# EasyEDA Pro project 蠕动泵.eprj

# Schematic Schematic1
Board Name: Board1; Create Date: 2025-11-30; Page Name: 控制; Project Name: 蠕动泵; Schematic Name: Schematic1; Update Date: 2025-12-03; Company: 嘉立创EDA; Page Size: A4; Version: V1.0
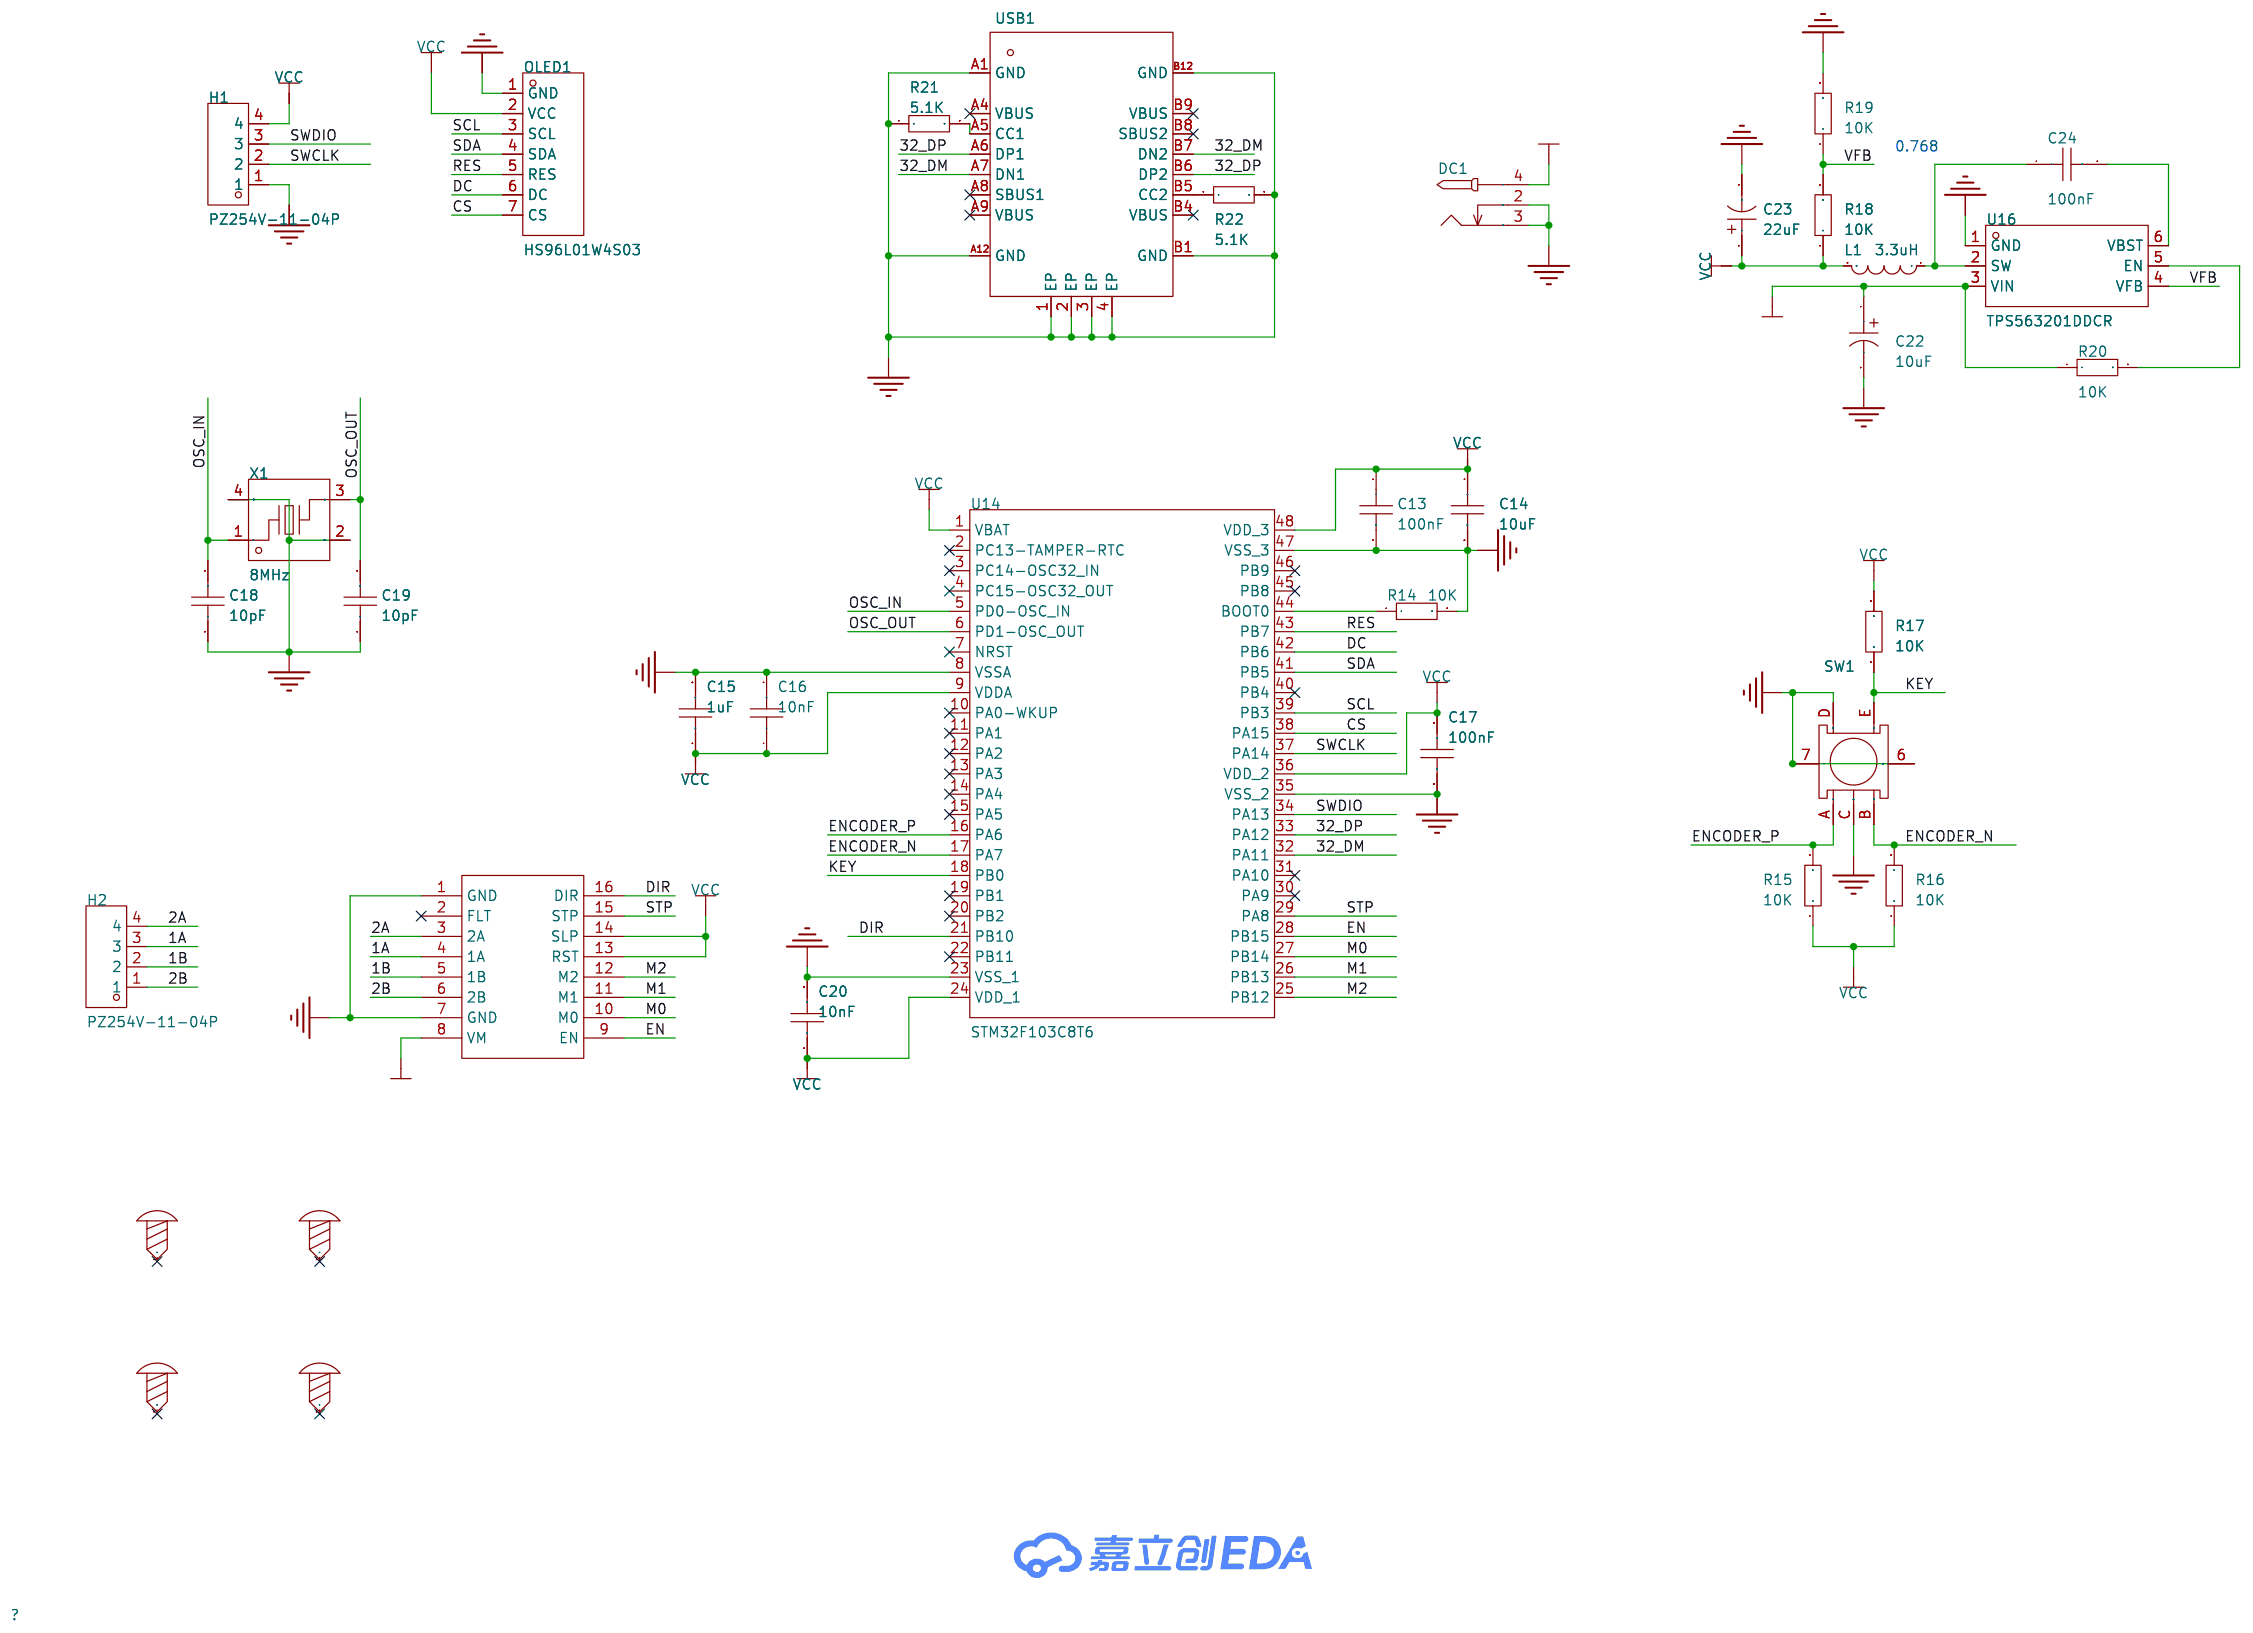
[diagram p0: schematic sheet]

## Parts
C13  100nF  [C0603]
C14  10uF  [C0603]
C15  1uF  [C0603]
C16  10nF  [C0603]
C17  100nF  [C0603]
C18  10pF  [C0603]
C19  10pF  [C0603]
C20  10nF  [C0603]
C22  10uF  [CAP-TH_BD4.0-P1.50-D0.5-FD]
C23  22uF  [CAP-TH_BD5.0-P2.00-D0.5-FD-1]
C24  100nF  [C0603]
DC1  -  [DC-2.0]
H1  PZ254V-11-04P  [HDR-TH_4P-P2.54-V-M]
H2  PZ254V-11-04P  [HDR-TH_4P-P2.54-V-M]
L1  3.3uH  [IND-SMD_L2.5-W2.0_AHP252010X]
OLED1  HS96L01W4S03  [OLED-TH_HS96L01W4S03]
R14  10K  [R0603]
R15  10K  [R0603]
R16  10K  [R0603]
R17  10K  [R0603]
R18  10K  [R0603]
R19  10K  [R0603]
R20  10K  [R0603]
R21  5.1K  [R0603]
R22  5.1K  [R0603]
SCREW1  -  [M3螺丝]
SCREW2  -  [M3螺丝]
SCREW3  -  [M3螺丝]
SCREW4  -  [M3螺丝]
SW1  -  [旋转编码器]
U1  -  [DRV8825模块]
U14  STM32F103C8T6  [LQFP-48_L7.0-W7.0-P0.50-LS9.0-BL]
U16  TPS563201DDCR  [SOT-23-6_L2.9-W1.6-P0.95-LS2.8-BR]
USB1  -  [USB_TYPE-C-16P]
X1  8MHz  [CRYSTAL-SMD_4P-L3.2-W2.5-BL]

## Library data of the parts
C13-C20 C24 = CAP_0603: Supplier Footprint: 0603
C22 = ECE-A1CKS100I: LCSC Part Name: 10uF ±20% 16V; Supplier Part: C1579406; Manufacturer: PANASONIC(松下); Supplier Footprint: 插件,D4xL5mm; JLCPCB Part Class: 扩展库; Datasheet: https://item.szlcsc.com/datasheet/ECE-A1CKS100I/1670221.html; Supplier: LCSC; Tolerance: ±20%; Voltage Rating: 16V; Ripple Current: 28mA@120Hz; Pin Spacing: 2.5mm; Diameter: 4mm; Height - Seated (Max): 5mm; Lifetime: 1000hrs@85℃; Operating Temperature: -40℃~+85℃
C23 = RGA220M1HBK-0511: LCSC Part Name: 22uF ±20% 50V; Supplier Part: C2920651; Manufacturer: Lelon(立隆); Supplier Footprint: 插件,D5xL11mm; JLCPCB Part Class: 扩展库; Datasheet: https://item.szlcsc.com/datasheet/RGA220M1HBK-0511/3224960.html; Supplier: LCSC; Tolerance: ±20%; Voltage Rating: 50V; Diameter: 5mm; Height - Seated (Max): 11mm; Operating Temperature: -40℃~+105℃
DC1 = DC-005_2.0: Supplier Footprint: 插件
H1 H2 = PZ254V-11-04P: LCSC Part Name: 1x4P 间距:2.54mm 方针 直插; Supplier Part: C2691448; Manufacturer: XFCN(兴飞); Supplier Footprint: 插件,P=2.54mm; JLCPCB Part Class: Extended Part; Datasheet: https://item.szlcsc.com/datasheet/PZ254V-11-04P/2801085.html; Supplier: LCSC; Pin Structure: 1x4P; Pitch: 2.54mm; Circluar Pins/Square Pins: 方针; Mounting Type: 直插; Number of Rows: 单排; Number of Pins: 4P; Current Rating: 3A; Voltage Rating (Max): 250V; Length of Mating Pin: 6mm; Insulation Height: 2.5mm; Length of End Connection Pin: 3mm; Operating Temperature: -40℃~+105℃; Color: 黑色
L1 = 74404024033: LCSC Part Name: 3.3uH ±20% 1.25A; Supplier Part: C2047400; Manufacturer: Wurth(伍尔特); Supplier Footprint: 2520; JLCPCB Part Class: 扩展库; Datasheet: https://www.we-online.com/components/products/datasheet/74404024033.pdf; Supplier: LCSC; Tolerance: ±20%; Current - Saturation(Isat): 1.25A; DC Resistance(DCR): 120mΩ; Ratings: AEC-Q200
OLED1 = HS96L01W4S03: LCSC Part Name: 0.96寸 白光 128x64像素分辨率; Supplier Part: C5139758; Manufacturer: HS(汉昇); JLCPCB Part Class: 扩展库; Datasheet: https://atta.szlcsc.com/upload/public/pdf/source/20231102/B1697FD352320B8236C71C910449C6BA.pdf; Supplier: LCSC
R14-R22 = Res_0603: Supplier Footprint: 0603
SCREW1-SCREW4 = M3螺丝: Supplier Footprint: 插件
SW1 = EC11E15244B2: Supplier Footprint: 插件
U1 = DRV8825模块
U14 = STM32F103C8T6: CPU内核:ARM Cortex-M3;CPU最大主频:72MHz;工作电压范围:2V~3.6V;内部振荡器:有;程序 FLASH容量:64K@x8bit;RAM总容量:20KB;EEPROM/数据 FLASH容量:-;GPIO端口数量:37;ADC(单元数/通道数/位数):1@x10ch/12bit;外设/功能/协议栈:温度传感器；DMA；看门狗；POR；PWM;工作温度范围:-40℃~+85℃;; LCSC Part Name: ARM Cortex-M3 72MHz 64K@x8bit 20KB MSL=3; Supplier Part: C8734; Manufacturer: ST(意法半导体); Supplier Footprint: LQFP-48_7x7x05P; JLCPCB Part Class: Basic Part; Datasheet: https://atta.szlcsc.com/upload/public/pdf/source/20140724/1457707174202.pdf; Supplier: LCSC; CPU Core: ARM Cortex-M3; Maximum Frequency: 72MHz; Supply Voltage Range: 2V~3.6V; Internal Oscillator: 有; Program FLASH Size: 64K@x8bit; RAM Size: 20KB; GPIO Ports Number: 37; ADC (Units/Channels/bits): 1@x10ch/12bit; Peripherals / Functions / Protocol Stacks: 温度传感器；DMA；看门狗；POR；PWM; Operating Temperature Range: -40℃~+85℃
U16 = TPS563201DDCR: LCSC Part Name: 4.5V至17V输入，3A同步降压电压调节器; Supplier Part: C116592; Manufacturer: TI(德州仪器); Supplier Footprint: SOT-23-THIN-6; JLCPCB Part Class: 扩展库; Datasheet: https://item.szlcsc.com/datasheet/TPS563201DDCR/117846.html; Supplier: LCSC; Function: 降压型; Output Type: 可调; Voltage - Supply: 4.5V~17V; Output Voltage: 768mV~7V; Output Current: 3A; Frequency - Switching: 580kHz; Operating Temperature: -40℃~+125℃@(TJ); Synchronous Rectifier: 是; Number of Outputs: 1; Topology: 降压式; Switch tube (built-in/external): 内置
USB1 = USB_TYPE-C-16P: Supplier Footprint: SMD
X1 = X32258MSB4SI: 晶振类型:贴片晶振;频率:8MHz;常温频差:±10ppm;负载电容:20pF;频率稳定度:±20ppm;; LCSC Part Name: YSX321SL 8MHZ 4P 3225 20PF ±10PPM -40~85℃ (±20PPM); Supplier Part: C2682774; Manufacturer: YXC(扬兴晶振); Supplier Footprint: SMD3225-4P; JLCPCB Part Class: 扩展库; Datasheet: https://item.szlcsc.com/datasheet/X32258MSB4SI/2777871.html; Supplier: LCSC; Type: 贴片晶振; Normal temperature Frequency Tolerance: ±10ppm; Load Capacitance: 20pF; Frequency Stability: ±20ppm; Equivalent Series Resistance(ESR): 120Ω; Operating Temperature: -40℃~+85℃

## Nets
12V: C22.1 DC1.4 R20.1 U1.8(VM) U16.3(VIN)
GND: C13.2 C14.2 C15.2 C16.2 C17.2 C18.1 C19.1 C20.2 C22.2 C23.2 DC1.2 DC1.3 H1.1 OLED1.1(GND) R14.2 R19.2 R21.1 R22.2 SW1.6 SW1.7 SW1.C SW1.D U1.1(GND) U1.7(GND) U14.8(VSSA) U14.23(VSS_1) U14.35(VSS_2) U14.47(VSS_3) U16.1(GND) USB1.1(EP) USB1.2(EP) USB1.3(EP) USB1.4(EP) USB1.A1(GND) USB1.A12(GND) USB1.B1(GND) USB1.B12(GND) X1.2(GND) X1.4(GND)
VCC: C13.1 C14.1 C15.1 C16.1 C17.1 C20.1 C23.1 H1.4 L1.2 OLED1.2(VCC) R15.1 R16.1 R17.2 R18.1 U1.13(RST) U1.14(SLP) U14.1(VBAT) U14.9(VDDA) U14.24(VDD_1) U14.36(VDD_2) U14.48(VDD_3)
1A: H2.3 U1.4(1A)
1B: H2.2 U1.5(1B)
2A: H2.4 U1.3(2A)
2B: H2.1 U1.6(2B)
32_DM: U14.32(PA11) USB1.A7(DN1) USB1.B7(DN2)
32_DP: U14.33(PA12) USB1.A6(DP1) USB1.B6(DP2)
CS: OLED1.7(CS) U14.38(PA15)
DC: OLED1.6(DC) U14.42(PB6)
DIR: U1.16(DIR) U14.21(PB10)
EN: U1.9(EN) U14.28(PB15)
ENCODER_N: R16.2 SW1.B U14.17(PA7)
ENCODER_P: R15.2 SW1.A U14.16(PA6)
KEY: R17.1 SW1.E U14.18(PB0)
M0: U1.10(M0) U14.27(PB14)
M1: U1.11(M1) U14.26(PB13)
M2: U1.12(M2) U14.25(PB12)
OSC_IN: C18.2 U14.5(PD0-OSC_IN) X1.1
OSC_OUT: C19.2 U14.6(PD1-OSC_OUT) X1.3
RES: OLED1.5(RES) U14.43(PB7)
SCL: OLED1.3(SCL) U14.39(PB3)
SDA: OLED1.4(SDA) U14.41(PB5)
STP: U1.15(STP) U14.29(PA8)
SWCLK: H1.2 U14.37(PA14)
SWDIO: H1.3 U14.34(PA13)
VFB: R18.2 R19.1 U16.4(VFB)
$1N1123: R14.1 U14.44(BOOT0)
$1N4436: C24.1 L1.1 U16.2(SW)
$1N4461: C24.2 U16.6(VBST)
$1N4466: R20.2 U16.5(EN)
$1N4698: R22.1 USB1.B5(CC2)
$1N4712: R21.2 USB1.A5(CC1)

Not connected (* = marked no-connect by the designer): SCREW1 1*; SCREW2 1*; SCREW3 1*; SCREW4 1*; U1 2(FLT)*; U14 2(PC13-TAMPER-RTC)* 3(PC14-OSC32_IN)* 4(PC15-OSC32_OUT)* 7(NRST)* 10(PA0-WKUP)* 11(PA1)* 12(PA2)* 13(PA3)* 14(PA4)* 15(PA5)* 19(PB1)* 20(PB2)* 22(PB11)* 30(PA9)* 31(PA10)* 40(PB4)* 45(PB8)* 46(PB9)*; USB1 A4(VBUS)* A8(SBUS1)* A9(VBUS)* B4(VBUS)* B8(SBUS2)* B9(VBUS)*

## Notes on the sheet
- 0.768

# Board PCB1
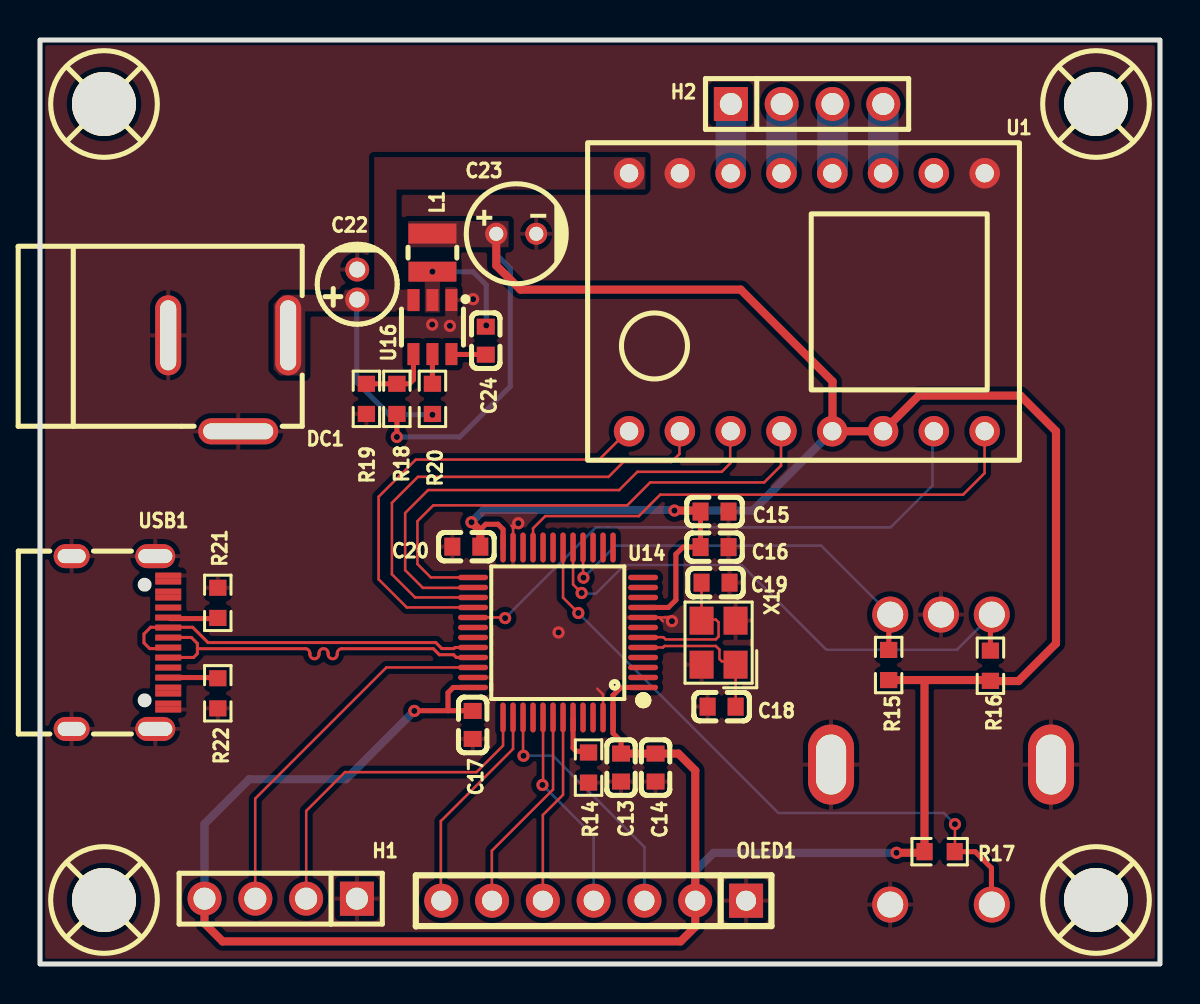
[diagram p1: board, top side]
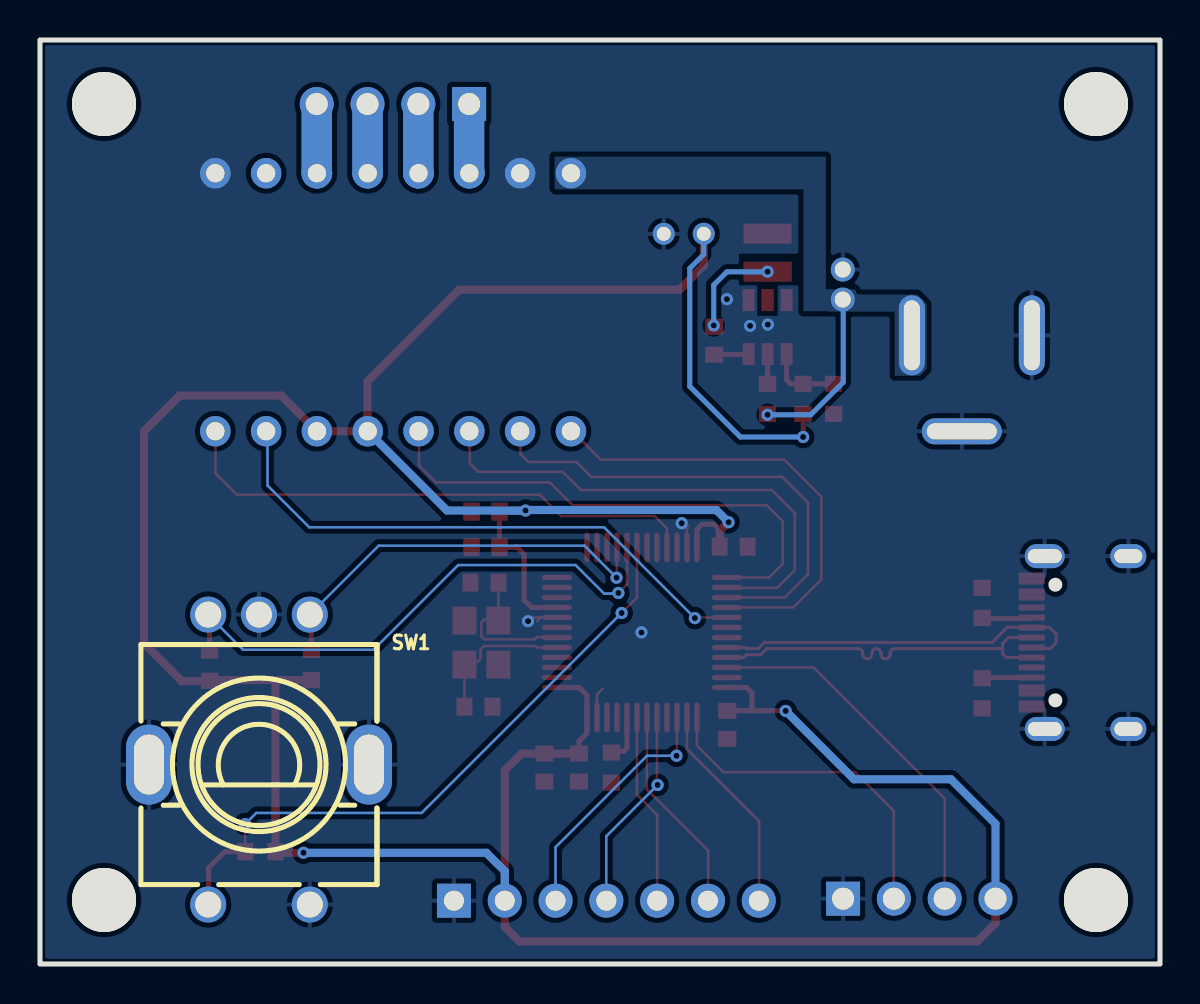
[diagram p2: board, bottom side, seen from below]

Outline 56 x 46.2 mm; copper layers: Top Layer, Bottom Layer. Coordinates in mm from the lower left corner of the outline.
Outline path: rectangle 0,46.2 56,0
Stack: Top Layer 0.035mm / Dielectric1 1.51mm FR4 er 4.5 / Bottom Layer 0.035mm

## Design rules (mm)
net OSC_IN: OSC
net OSC_OUT: OSC
net 32_DM: DP
net 32_DP: DP
template: 自定义配置
spacing copperThickness1oz (default): track to track 0.102, other pairs 0.152 to 0.3
spacing copperThickness2oz: track to track 0.203, other pairs 0.152 to 0.3
track width copperThickness1oz (default): min 0.127, default 0.127, max 2.54
track width copperThickness2oz: min 0.203, default 0.254, max 2.54
track width POWER: min 0.127, default 0.406, max 2.54
differential pair differentialPair (default): width min 0.127, default 0.254, max 2.54; gap min 0.152, default 0.152
via viaSize (default): diameter min 0.5, default 0.61, max 10; hole min 0.3, default 0.305, max 6.3
net VCC uses POWER
net 12V uses POWER

## Placement (name value [footprint] x y rotation side)
C13  100nF  [C0603]  29.05 9.82 270 top
C14  10uF  [C0603]  30.78 9.82 270 top
C15  1uF  [C0603]  33.73 22.62 0 top
C16  10nF  [C0603]  33.73 20.84 0 top
C17  100nF  [C0603]  21.63 11.95 270 top
C18  10pF  [C0603]  34.08 12.87 0 top
C19  10pF  [C0603]  33.78 19.07 180 top
C20  10nF  [C0603]  21.32 20.87 180 top
C22  10uF  [CAP-TH_BD4.0-P1.50-D0.5-FD]  15.86 33.97 90 top
C23  22uF  [CAP-TH_BD5.0-P2.00-D0.5-FD-1]  23.81 36.51 0 top
C24  100nF  [C0603]  22.29 31.17 270 top
DC1  -  [DC-2.0]  9.28 31.7 180 top
H1  PZ254V-11-04P  [HDR-TH_4P-P2.54-V-M]  12.04 3.27 180 top
H2  PZ254V-11-04P  [HDR-TH_4P-P2.54-V-M]  38.35 43 0 top
L1  3.3uH  [IND-SMD_L2.5-W2.0_AHP252010X]  19.62 35.57 90 top
OLED1  HS96L01W4S03  [OLED-TH_HS96L01W4S03]  27.68 3.17 180 top
R14  10K  [R0603]  27.43 9.82 270 top
R15  10K  [R0603]  42.43 14.95 90 top
R16  10K  [R0603]  47.52 14.91 90 top
R17  10K  [R0603]  44.98 5.62 180 top
R18  10K  [R0603]  17.84 28.26 90 top
R19  10K  [R0603]  16.32 28.26 270 top
R20  10K  [R0603]  19.62 28.26 90 top
R21  5.1K  [R0603]  8.89 18.06 270 top
R22  5.1K  [R0603]  8.89 13.54 270 top
SCREW1  -  [M3螺丝]  3.2 3.2 0 top
SCREW2  -  [M3螺丝]  52.8 3.2 0 top
SCREW3  -  [M3螺丝]  52.8 43 0 top
SCREW4  -  [M3螺丝]  3.2 43 0 top
SW1  -  [旋转编码器]  45.05 9.95 0 bottom
U1  -  [DRV8825模块]  49.01 41.06 270 top
U14  STM32F103C8T6  [LQFP-48_L7.0-W7.0-P0.50-LS9.0-BL]  25.9 16.58 90 top
U16  TPS563201DDCR  [SOT-23-6_L2.9-W1.6-P0.95-LS2.8-BR]  19.62 31.84 90 top
USB1  -  [USB_TYPE-C-16P]  4 16.2 270 top
X1  8MHz  [CRYSTAL-SMD_4P-L3.2-W2.5-BL]  33.93 16.07 90 top

## Footprints (pads in the part's own frame, mm; a bottom-side part is the same pattern mirrored in y, then rotated)
C0603
  rect 0.8x0.9 smd: 1(-0.7,0) 2(0.7,0)
CAP-TH_BD4.0-P1.50-D0.5-FD
  round 1.2 hole 0.8: 1(-0.75,0) 2(0.75,0)
CAP-TH_BD5.0-P2.00-D0.5-FD-1
  round 1.1 hole 0.7: 1(-1,0) 2(1,0)
CRYSTAL-SMD_4P-L3.2-W2.5-BL
  rect 1.4x1.2 smd: 1(-1.1,-0.85) 2(1.1,-0.85) 3(1.1,0.85) 4(-1.1,0.85)
DC-2.0
  oval 4x1.3 hole 3.5x0.8: 2(-0.627,5.067)
  oval 1.3x4 hole 0.8x3.5: 3(2.873,0.267) 4(-3.127,0.267)
DRV8825模块
  round 1.524 hole 0.914: 1(1.524,-1.778) 2(1.524,-4.318) 3(1.524,-6.858) 4(1.524,-9.398) 5(1.524,-11.938) 6(1.524,-14.478) 7(1.524,-17.018) 8(1.524,-19.558) 9(14.424,-19.558) 10(14.424,-17.018) 11(14.424,-14.478) 12(14.424,-11.938) 13(14.424,-9.398) 14(14.424,-6.858) 15(14.424,-4.318) 16(14.424,-1.778)
HDR-TH_4P-P2.54-V-M
  rect 1.7x1.7 hole 1.1: 1(-3.81,0)
  round 1.7 hole 1.1: 2(-1.27,0) 3(1.27,0) 4(3.81,0)
IND-SMD_L2.5-W2.0_AHP252010X
  rect 1x2.4 smd: 1(-0.95,0) 2(0.95,0)
LQFP-48_L7.0-W7.0-P0.50-LS9.0-BL
  oval 0.27x1.5 smd: 1(-2.75,-4.25) 2(-2.25,-4.25) 3(-1.75,-4.25) 4(-1.25,-4.25) 5(-0.75,-4.25) 6(-0.25,-4.25) 7(0.25,-4.25) 8(0.75,-4.25) 9(1.25,-4.25) 10(1.75,-4.25) 11(2.25,-4.25) 12(2.75,-4.25) 25(2.75,4.25) 26(2.25,4.25) 27(1.75,4.25) 28(1.25,4.25) 29(0.75,4.25) 30(0.25,4.25) 31(-0.25,4.25) 32(-0.75,4.25) 33(-1.25,4.25) 34(-1.75,4.25) 35(-2.25,4.25) 36(-2.75,4.25)
  oval 1.5x0.27 smd: 13(4.25,-2.75) 14(4.25,-2.25) 15(4.25,-1.75) 16(4.25,-1.25) 17(4.25,-0.75) 18(4.25,-0.25) 19(4.25,0.25) 20(4.25,0.75) 21(4.25,1.25) 22(4.25,1.75) 23(4.25,2.25) 24(4.25,2.75) 37(-4.25,2.75) 38(-4.25,2.25) 39(-4.25,1.75) 40(-4.25,1.25) 41(-4.25,0.75) 42(-4.25,0.25) 43(-4.25,-0.25) 44(-4.25,-0.75) 45(-4.25,-1.25) 46(-4.25,-1.75) 47(-4.25,-2.25) 48(-4.25,-2.75)
M3螺丝
  round 3.2 hole 3.2: 1(0,0)
OLED-TH_HS96L01W4S03
  rect 1.7x1.7 hole 1: 1(-7.62,0)
  round 1.7 hole 1: 2(-5.08,0) 3(-2.54,0) 4(0,0) 5(2.54,0) 6(5.08,0) 7(7.62,0)
R0603
  rect 0.806x0.864 smd: 1(-0.753,0) 2(0.753,0)
SOT-23-6_L2.9-W1.6-P0.95-LS2.8-BR
  rect 1.1x0.6 smd: 1(1.35,-0.95) 2(1.35,0) 3(1.35,0.95) 4(-1.35,0.95) 5(-1.35,0) 6(-1.35,-0.95)
USB_TYPE-C-16P
  oval 1.2x2 hole 0.7x1.7: 1(-4.193,1.765) 2(4.447,1.765)
  oval 1.2x1.8 hole 0.7x1.4: 3(-4.193,-2.415) 4(4.447,-2.415)
  rect 0.3x1.3 smd: A1(-3.223,2.415) A4(-2.423,2.415) A5(-1.123,2.415) A6(-0.123,2.415) A7(0.377,2.415) A8(1.377,2.415) A9(2.677,2.415) A12(3.477,2.415) B1(3.177,2.415) B4(2.377,2.415) B5(1.877,2.415) B6(0.877,2.415) B7(-0.623,2.415) B8(-1.623,2.415) B9(-2.123,2.415) B12(-2.923,2.415)
旋转编码器
  oval 2.301x4 hole 1.501x2.999: 6(5.499,-0.023) 7(-5.499,-0.023)
  round 1.801 hole 1.3: A(-2.54,-7.521) B(2.54,-7.521) C(0,-7.521) D(-2.54,6.977) E(2.54,6.977)

## Nets
As in the schematic.

Pads without a net: SCREW1 1; SCREW2 1; SCREW3 1; SCREW4 1; U1 2; U14 2 3 4 7 10 11 12 13 14 15 19 20 22 30 31 40 45 46; USB1 A4 A8 A9 B4 B8 B9

## Via types
v1: diameter 0.61, hole 0.305, Top Layer to Bottom Layer, 21 vias

## Routing (per net, layer and track width the routed paths; a pad name or vN(x,y) marks a point on that pad's centre or on a via; arc(x,y) is an arc through that point)
12V: length 8.6
  Bottom Layer w0.254: v1(19.62,27.46) 17.46,27.46 15.84,29.09 15.84,33.2 C22.1
GND: length 4.8
  Top Layer w0.127: U14.8 30.96,17.33 ; 30.96,17.33 31.41,17.33 v1(31.6,17.14) ; 30.96,17.33 31.14,17.14 ; 23.65,21.78 v1(23.91,22.04) ; 23.65,21.78 23.65,21.84 23.57,21.92 ; 23.65,21.78 U14.23 ; U14.47 28.15,13.48 27.86,13.76
  vias: v1(19.61,31.97) v1(20.5,31.91) v1(21.65,33.24) v1(25.93,16.58)
VCC: length 190.4
  Top Layer w0.254: v1(18.72,12.65) 18.73,12.67 20.4,12.67 ; U14.9 31.42,17.83 31.79,18.2 31.79,20.49 32.15,20.84 C16.1 33.03,22.57 ; C13.1 29.05,11.14 28.65,11.54 U14.48 ; v1(17.84,26.35) R18.1 ; U14.24 23.15,20.83 23.15,21.73 22.9,21.99 22.29,21.99 22.02,21.72 ; C17.1 21.62,12.67 20.4,12.67 ; 20.4,12.67 20.4,13.56 20.66,13.83 U14.36 ; U14.1 29.04,13.83 28.65,13.43 28.65,12.33
  Top Layer w0.406: 44.25,14.2 47.48,14.2 R16.1 47.53,14.15 48.92,14.15 50.8,16.03 50.8,26.64 49.02,28.42 43.94,28.42 U1.14 U1.13 39.63,26.65 39.63,29.13 35.04,33.72 24.02,33.72 22.81,34.93 C23.1 ; 44.25,14.2 R15.1 ; 44.25,14.2 44.23,14.17 R17.2 44.17,5.56 v1(42.82,5.56) ; v1(31.72,22.67) 32.92,22.67 32.97,22.62 C15.1 ; C20.1 22.02,21.64 v1(21.57,22.09) ; H1.4 8.23,2.03 9.13,1.13 32.03,1.13 32.76,1.86 OLED1.2 32.76,9.68 31.92,10.52 C14.1 C13.1
  Bottom Layer w0.254: C23.1 22.81,35.48 23.51,34.78 23.51,28.88 20.98,26.35 v1(17.84,26.35)
  Bottom Layer w0.406: H1.4 8.23,7.01 10.46,9.24 15.3,9.24 v1(18.72,12.65) ; U1.13 35.65,22.67 v1(31.72,22.67) 31.69,22.7 22.19,22.7 v1(21.57,22.09) ; OLED1.2 32.76,4.64 33.68,5.56 v1(42.82,5.56)
1A: length 3.5
  Bottom Layer w1.524: U1.4 39.62,39.55 H2.3
1B: length 3.5
  Bottom Layer w1.524: U1.5 37.08,39.55 H2.2
2A: length 3.5
  Bottom Layer w1.524: U1.3 42.16,39.55 H2.4
2B: length 3.5
  Bottom Layer w1.524: H2.1 34.54,39.55 U1.6
32_DM: length 18.9
  Top Layer w0.152: U14.32 20.75,15.83 20.7,15.77 20.09,15.77 19.79,16.07 8.4,16.07 7.63,16.84 5.53,16.84 5.2,16.5 5.2,16.06 5.48,15.77 6.47,15.77
32_DP: length 18.8
  Top Layer w0.152: 7.87,15.77 13.26,15.77 arc(13.43,15.7) 13.49,15.54 13.49,15.49 arc(13.72,15.26) 13.95,15.49 13.95,15.54 arc(14.18,15.77) 14.41,15.54 14.41,15.49 arc(14.64,15.26) 14.86,15.49 14.86,15.54 arc(14.93,15.7) 15.09,15.77 19.66,15.77 19.97,15.46 20.68,15.46 20.82,15.33 U14.33 ; 7.87,15.77 7.87,15.52 7.68,15.33 6.52,15.33 6.47,15.27 ; 7.87,15.77 7.87,16.03 7.57,16.33 6.52,16.33 6.47,16.27
CS: length 10.7
  Top Layer w0.127: U14.38 23.65,10.76 20.04,7.15 20.04,3.19 OLED1.7
DC: length 10.4
  Top Layer w0.127: U14.42 25.65,8.73 22.59,5.67 22.59,3.17 OLED1.6
DIR: length 26.8
  Top Layer w0.127: U14.21 24.65,21.78 25.26,22.4 29.94,22.4 31.01,23.47 46.16,23.47 47.23,24.54 47.23,26.68 47.21,26.69
EN: length 23.3
  Top Layer w0.127: 29.43,26.69 27.96,25.22 18.79,25.22 16.93,23.36 16.93,19.23 18.34,17.83 U14.28
ENCODER_N: length 27.9
  Top Layer w0.127: U14.17 26.65,18.98 v1(27.08,18.55)
  Top Layer w0.254: R16.2 47.52,17.51
  Bottom Layer w0.127: v1(27.08,18.55) 27.11,18.52 27.8,18.52 29.22,19.95 35.09,19.95 39.32,15.71 45.85,15.71 47.59,17.46 47.59,17.47
ENCODER_P: length 20.7
  Top Layer w0.127: v1(27.17,19.32) 27.15,19.34 U14.16
  Top Layer w0.254: 42.44,17.56 42.44,15.87 42.39,15.82
  Bottom Layer w0.127: SW1.A 39.06,20.92 28.77,20.92 v1(27.17,19.32)
KEY: length 32.1
  Top Layer w0.127: v1(45.75,6.99) 45.75,5.63 R17.1 ; U14.18 26.15,18.32 v1(26.92,17.55)
  Top Layer w0.254: 47.57,3.07 47.57,4.8 46.76,5.62 R17.1
  Bottom Layer w0.127: v1(45.75,6.99) 45.19,7.55 36.91,7.55 v1(26.92,17.55)
M0: length 24.7
  Top Layer w0.127: 31.97,26.69 31.97,25.5 31.57,25.1 29.17,25.1 28.43,24.36 18.89,24.36 17.59,23.06 17.59,19.49 18.76,18.33 U14.27
M1: length 25.6
  Top Layer w0.127: 34.51,26.69 34.51,25.03 34.09,24.61 29.87,24.61 28.96,23.7 19.41,23.7 18.26,22.55 18.26,19.69 19.14,18.81 21.63,18.81 U14.26
M2: length 26.3
  Top Layer w0.127: U14.25 19.54,19.33 18.87,20 18.87,22.14 19.66,22.93 29.36,22.93 30.51,24.08 36.21,24.08 37.05,24.92 37.05,26.69
OSC_IN: length 7.4
  Top Layer w0.127: U14.5 31.15,15.83 31.22,15.9 33.79,15.9 33.97,15.72 33.97,15.25 34.09,15.13 34.62,15.13 34.74,15.01 ; 34.78,12.82 34.78,14.86 34.78,14.87 X1.1
OSC_OUT: length 7.3
  Top Layer w0.127: 30.3,16.29 30.35,16.34 31.16,16.34 31.27,16.23 33.79,16.23 33.93,16.37 33.93,17.08 33.79,17.22 33.13,17.22 X1.3 33.08,17.17 C19.2
RES: length 9.6
  Top Layer w0.127: U14.43 26.15,8.46 25.14,7.45 OLED1.5
SCL: length 12.5
  Top Layer w0.127: v1(24.17,10.41) 24.15,10.43 U14.39
  Bottom Layer w0.127: OLED1.3 30.22,5.84 25.65,10.41 v1(24.17,10.41)
SDA: length 10.2
  Top Layer w0.127: U14.41 25.15,8.98 v1(25.12,8.95)
  Bottom Layer w0.127: OLED1.4 27.68,6.39 v1(25.12,8.95)
STP: length 28.5
  Top Layer w0.127: U14.29 23.23,17.33 v1(23.26,17.3)
  Bottom Layer w0.127: 44.67,26.69 44.63,26.65 44.63,23.93 42.53,21.83 27.8,21.83 v1(23.26,17.3)
SWCLK: length 17
  Top Layer w0.127: U14.37 23.15,10.92 21.83,9.59 15.25,9.59 13.31,7.66 13.31,3.27 H1.2
SWDIO: length 18.6
  Top Layer w0.127: H1.3 10.76,3.27 10.76,8.27 17.32,14.83 U14.34
VFB: length 3.7
  Top Layer w0.254: R19.1 R18.2 18.47,29.01 18.67,29.21 U16.4
$1N1123: length 2.3
  Top Layer w0.254: U14.44 26.65,10.8 26.82,10.63 27.38,10.63
$1N4436: length 5
  Bottom Layer w0.254: v1(22.31,31.93) 22.31,33.95 21.65,34.61 19.63,34.61 v1(19.62,34.62)
$1N4461: length 1.7
  Top Layer w0.254: U16.6 20.59,30.48 22.25,30.48 22.29,30.52
$1N4466: length 1.5
  Top Layer w0.254: U16.5 R20.2
$1N4698: length 2
  Top Layer w0.254: 8.49,14.3 8.47,14.32 6.47,14.32
$1N4712: length 2
  Top Layer w0.254: 6.47,17.32 6.52,17.27 8.49,17.27

## Copper pours and planes (outline as drawn; the poured copper is in the pictures)
12V on Top Layer: 16.42,40.35 30.27,40.35 30.27,32.62 16.42,32.62
12V on Top Layer: 15.94,33.72 18.99,33.72 18.99,32.7 15.94,32.7
12V on Top Layer: 11.68,33.72 16.57,33.72 16.57,29.42 11.68,29.42
12V on Bottom Layer: 11.68,33.72 16.57,33.72 16.57,29.42 11.68,29.42
12V on Bottom Layer: 11.68,33.72 16.57,33.72 16.57,29.42 11.68,29.42
12V on Bottom Layer: 16.42,40.37 30.27,40.37 30.27,32.64 16.42,32.64
GND on Top Layer: 0,46.2 56,46.2 56,0 0,0
GND on Top Layer: 18.29,33.84 20.87,33.84 20.87,31.43 18.29,31.43
GND on Top Layer: 46.03,41.53 48.67,41.53 48.67,37.97 46.03,37.97
GND on Top Layer: 30.78,40.77 33.32,40.77 33.32,38.22 30.78,38.22
GND on Bottom Layer: 30.84,41.06 33.32,41.06 33.32,38.22 30.84,38.22
GND on Bottom Layer: 0,46.4 56,46.4 56,0.2 0,0.2
GND on Bottom Layer: 46.06,41.06 48.56,41.06 48.56,38.22 46.06,38.22
VCC on Top Layer: 18.4,37.15 23.43,37.15 23.43,35.84 18.4,35.84
$1N4436 on Top Layer: 19.24,34.35 20,34.35 20,32.57 19.24,32.57
